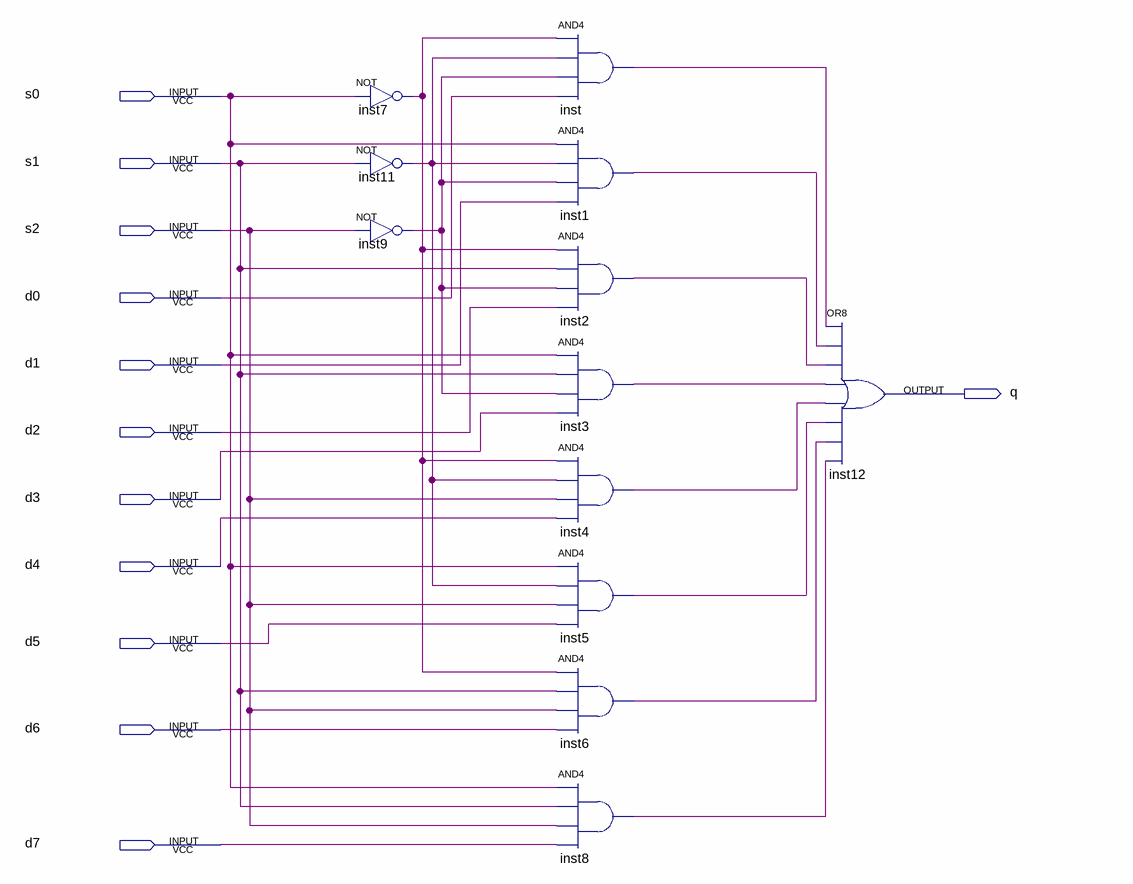
[diagram p0: schematic sheet]
// Quartus schematic mux8para1.bdf as structural Verilog: 12 symbols, 12 pins
module mux8para1 (
  input  s0,
  input  s1,
  input  s2,
  input  d0,
  input  d1,
  input  d2,
  input  d3,
  input  d4,
  input  d5,
  input  d6,
  input  d7,
  output q
);

  wire inst1_out, inst2_out, inst3_out, inst4_out, inst5_out, inst6_out, inst7_out, inst8_out, inst9_out,
       inst11_out, inst_out;

  not inst7 (inst7_out, s0);
  not inst11 (inst11_out, s1);
  not inst9 (inst9_out, s2);
  and inst (inst_out, inst7_out, inst11_out, inst9_out, d0);
  and inst1 (inst1_out, s0, inst11_out, inst9_out, d1);
  and inst2 (inst2_out, inst7_out, s1, inst9_out, d2);
  and inst3 (inst3_out, s0, s1, inst9_out, d3);
  and inst4 (inst4_out, inst7_out, inst11_out, s2, d4);
  and inst5 (inst5_out, s0, inst11_out, s2, d5);
  and inst6 (inst6_out, inst7_out, s1, s2, d6);
  and inst8 (inst8_out, s0, s1, s2, d7);
  or inst12 (q, inst_out, inst1_out, inst2_out, inst3_out, inst4_out, inst5_out, inst6_out, inst8_out);
endmodule
